# Altium schematic sheet 2_Input Signal Conditioner.SchDoc
size A4; SheetNumber: 3; SheetTotal: 6
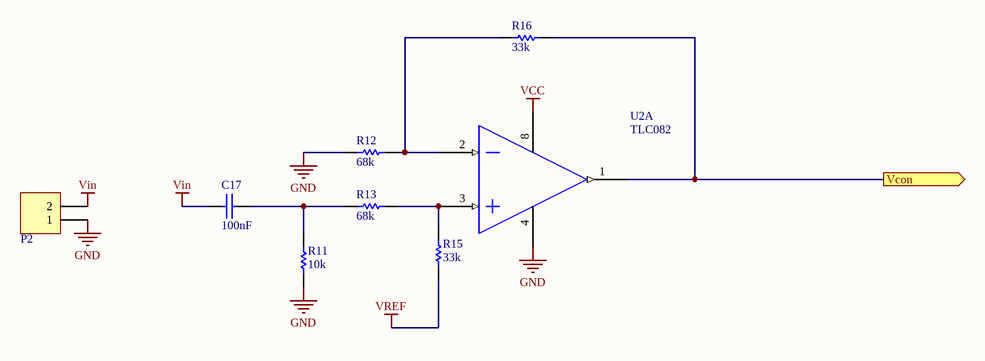
[diagram p0: 2_Input Signal Conditioner.SchDoc]

## Parts
C17  100nF  [ece-RAD0.2]
P2  Header 2  [ece-TER2-10MM]  (value not drawn)
R11  10k  [ece-AXIAL0.4]
R12  68k  [ece-AXIAL0.4]
R13  68k  [ece-AXIAL0.4]
R15  33k  [ece-AXIAL0.4]
R16  33k  [ece-AXIAL0.4]
U2  TLC082  [ECE-DIP8]  (part A of 2)

## Ports
Vcon (out)

## Nets
GND: P2.1 R11.1 R12.2 U2.4(GND)
VCC: U2.8(V(+))
Vin: C17.1 P2.2
VREF: R15.1
Vcon: R16.1 U2.1(OUT1) ; port Vcon
NetC17_2: C17.2 R11.2 R13.2
NetR12_1: R12.1 R16.2 U2.2(IN1(-))
NetR13_1: R13.1 R15.2 U2.3(IN1(+))

## Library data of the parts
C17 = CAP: Capacitor Non Polarised Through Hole; Value: 100nF
P2 = TERMINAL 2: Large 2 way screw connector
R11-R13 R15 R16 = Res1: Resistor; Published: 8-Jun-2000; LatestRevisionDate: 17-Jul-2002; LatestRevisionNote: Re-released for DXP Platform.; PackageReference: AXIAL-0.3; Publisher: Altium Limited
  R11: Value: 10k
  R12 R13: Value: 68k
  R15 R16: Value: 33k
U2 = TLC082: Value: TLC082